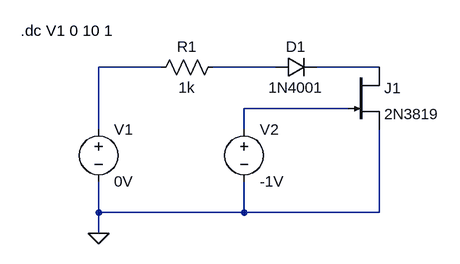
[diagram p0: schematic Draft2.asc]
Draft2.asc, the LTspice schematic file:
Version 4
SHEET 1 880 680
WIRE 224 176 128 176
WIRE 400 176 304 176
WIRE 560 176 464 176
WIRE 512 240 352 240
WIRE 128 272 128 176
WIRE 352 272 352 240
WIRE 128 400 128 352
WIRE 352 400 352 352
WIRE 352 400 128 400
WIRE 560 400 560 272
WIRE 560 400 352 400
WIRE 128 432 128 400
FLAG 128 432 0
SYMBOL voltage 128 256 R0
SYMATTR InstName V1
SYMATTR Value 0V
SYMBOL voltage 352 256 R0
SYMATTR InstName V2
SYMATTR Value -1V
SYMBOL njf 512 176 R0
SYMATTR InstName J1
SYMATTR Value 2N3819
SYMBOL diode 400 192 R270
WINDOW 0 32 32 VTop 2
WINDOW 3 0 32 VBottom 2
SYMATTR InstName D1
SYMATTR Value 1N4001
SYMBOL res 320 160 R90
WINDOW 0 0 56 VBottom 2
WINDOW 3 32 56 VTop 2
SYMATTR InstName R1
SYMATTR Value 1k
TEXT 8 120 Left 2 !.dc V1 0 10 1

The netlist it stands for:
* Draft2.asc
V1 N001 0 0V
V2 N004 0 -1V
J1 N003 N004 0 2N3819
D1 N002 N003 1N4001
R1 N002 N001 1k
.model D D
.lib standard.dio
.model NJF NJF
.model PJF PJF
.lib standard.jft
.dc V1 0 10 1
.backanno
.end